# EAGLE schematic LC Filter (EAGLE 9.6.2)
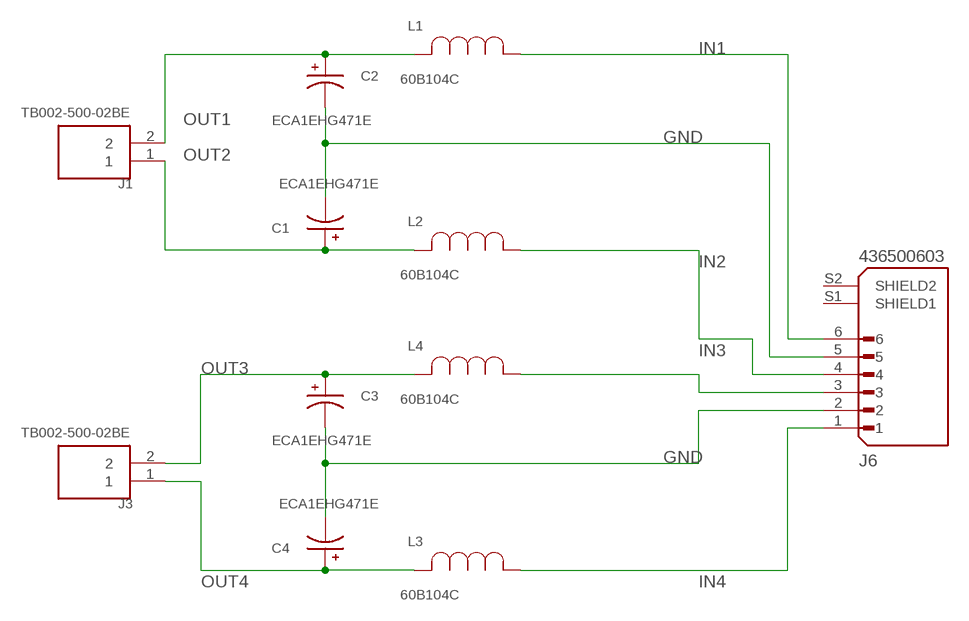
[diagram p0: schematic, sheet 1]

## Parts
C1  ECA1EHG471E  [CAPPRD500W60D1000H1250]
C2  ECA1EHG471E  [CAPPRD500W60D1000H1250]
C3  ECA1EHG471E  [CAPPRD500W60D1000H1250]
C4  ECA1EHG471E  [CAPPRD500W60D1000H1250]
J1  TB002-500-02BE  [CUI_TB002-500-02BE]
J3  TB002-500-02BE  [CUI_TB002-500-02BE]
J6  436500603  [MOLEX_436500603]
L1  60B104C  [6000B_SERIES_MUR]
L2  60B104C  [6000B_SERIES_MUR]
L3  60B104C  [6000B_SERIES_MUR]
L4  60B104C  [6000B_SERIES_MUR]

## Nets
GND: C1.N C2.N C3.N C4.N J6.2 J6.5
IN1: J6.6 L1.1
IN2: J6.4 L2.1
IN3: J6.3 L4.1
IN4: J6.1 L3.1
OUT1: C2.P J1.2 L1.2
OUT2: C1.P J1.1 L2.2
OUT3: C3.P J3.2 L4.2
OUT4: C4.P J3.1 L3.2
Unconnected: J6.S1(SHIELD1) J6.S2(SHIELD2)

## Library data of the parts
C1-C4 = SnapEDA Library:ECA1EHG471E: NHG-A; A_MAX: 12.5; B_MAX: 0.65; B_NOM: 0.6; DESCRIPTION: NHG-A; D_NOM: 10; E_NOM: 5; MF: PANASONIC; PARTREV: 20-DEC-19
J1 J3 = SnapEDA Library:TB002-500-02BE; MANUFACTURER: CUI; STANDARD: Manufacturer Recommendations
J6 = SnapEDA Library:436500603; MANUFACTURER: Molex; MAXIMUM_PACKAGE_HEIGHT: 5.57 mm; PARTREV: F3; STANDARD: Manufacturer Recommendations
L1-L4 = SnapEDA Library:60B104C; COPYRIGHT: Copyright (C) 2022 Ultra Librarian. All rights reserved.; MANUFACTURER_PART_NUMBER: 60B104C; MFR_NAME: Murata